# Altium schematic sheet Volatage_regulator.SchDoc
size A4; SheetNumber: 2; SheetTotal: 4
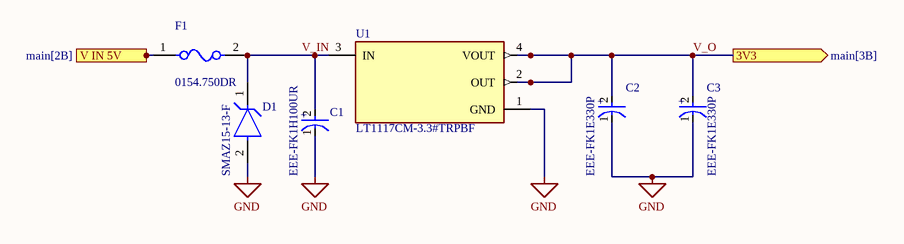
[diagram p0: Volatage_regulator.SchDoc]

## Parts
C1  EEE-FK1H100UR  [FP-FKC-MFG]
C2  EEE-FK1E330P  [FP-FKD-MFG]
C3  EEE-FK1E330P  [FP-FKD-MFG]
D1  SMAZ15-13-F  [FP-SMA-MFG]
F1  0154.750DR  [FP-0154-MFG]
U1  LT1117CM-3.3#TRPBF  [FP-M-3-05-08-1460-MFG]

## Ports
3V3 (out, see main[3B]), V IN 5V (in, see main[2B])

## Nets
GND: C1.1(C) C2.1(C) C3.1(C) D1.2(A) U1.1(GND)
V IN 5V: F1.1 ; port V IN 5V
V_IN: C1.2(A) D1.1(C) F1.2 U1.3(IN)
V_O: C2.2(A) C3.2(A) U1.2(OUT) U1.4(VOUT) ; port 3V3

## Notes on the sheet
- (in symbol CMP-00287-39481004-1) +
- (in symbol CMP-05427-000030-1) +

## Library data of the parts
C1 = CMP-05427-000030-1: CAP ALUM 10UF 20% 50V SMD; Impedance: 1.52R; Ripple Current (AC): 85mA; Life (Hours): 2000Hour; Leakage Current: 3uA; Dielectric Material: Aluminium; Length: 5.8mm; Voltage Rating: 50V; Radiation Hardening: No; Max Operating Temperature: 105°C; REACH SVHC: No SVHC; Tolerance: 20%; RoHS Compliant: Yes; Case/Package: Radial; Height: 5.8mm; Voltage: 50V; Diameter: 5mm; Number of Pins: 2; Ripple Current: 85mA; Series: FK; Lead Free: Lead Free; Width: 6.5mm; ESR (Equivalent Series Resistance): 1.52R; Package Quantity: 1000; Construction: Cylindrical; Voltage Rating (DC): 50V; Packaging: Tape and Reel; Height - Seated (Max): 0.228inch; Contact Plating: Tin; Capacitance: 10uF; Min Operating Temperature: -55°C; Termination: SMD/SMT; Material: Aluminium; Mount: Surface Mount
C2 C3 = CMP-00287-39481004-1: EEE-FK1E330P Aluminum Electrolytic Capacitor, 33 uF, 25 V, ± 20%, 2000 hours @ 105°C, Radial Can - SMD; Voltage: 25V; Polarity: Polar; Ripple Current (AC): 240mA; Impedance: 360mΩ; Leakage Current: 3µA; Capacitance: 33µF; Mount: PCB, Surface Mount; Radiation Hardening: No; Life (Hours): 2000hours; RoHS: Compliant; Packaging: Cut Tape; Case/Package: Radial; Number of Pins: 2; NexarPartId: 39481004; Contact Plating: Tin; Voltage Rating (DC): 25V; Voltage Rating: 25V; Width: 7.8mm; Diameter: 6.3mm; Termination: SMD/SMT; Min Operating Temperature: -55°C; Schedule B: 8532220020; Lifecycle Status: Production; Lead Free: Lead Free; Tolerance: 20%; REACH SVHC: No SVHC; ESR (Equivalent Series Resistance): 360mΩ; Height - Seated (Max): 6.096mm; Height: 5.8mm; Ripple Current: 240mA; Length: 5.8mm; Max Operating Temperature: 105°C
D1 = CMP-12792-000022-1: DIODE ZENER 15V 1W SMA; Manufacturer: Diodes; Forward Current: 200mA; Max Reverse Leakage Current: 1uA; Max Junction Temp: +150°C; Standoff Height: 0.05mm; Reverse Voltage: 11.4V; Zener Impedance: 10Ω; Max Zener Voltage: 15.75V; ComponentLink2URL: https://www.diodes.com/assets/Datasheets/ds18015.pdf; ComponentLink2Description: Datasheet; Nom Zener Voltage: 15V; Category: Diode; Device Class L2: Diodes; Lead Free: Yes; Power Dissipation: 1W; Automotive: No; Octopart: https://octopart.com/smaz15-13-f-diodes+inc.-334038; Temperature Range Low: -65°C; Temperature Range High: +150°C; Package: SMA; Temperature: -65°C to +150°C; Digikey Description: DIODE ZENER 15V 1W SMA; Manufacturer Part Number: SMAZ15-13-F; Mouser Description: Zener Diodes 15V 1W; Footprint Url: https://www.diodes.com/assets/Package-Files/SMA.pdf; Device Class L3: Zener Diodes; RoHS: TRUE; Device Class L1: Discrete Semiconductors; Height: 2.4mm
F1 = CMP-08605-000067-1: FUSE BOARD MNT 750MA 125VAC/VDC; Manufacturer: Littelfuse Inc; Max Fuse Dc Voltage: 125V; Fuse Current: 0.75A; Fuse Blow Speed: Fast; Device Class L3: unset; Automotive: No; ComponentLink2Description: Datasheet; Max Fuse Ac Voltage: 125V; Temperature Range Low: -55°C; Temperature: -55°C to +125°C; Mouser Description: Fuse Chip Very Fast Acting 0.75A SMD Solder Pad 9.73 X 5.03 X 3.81mm T/R CSA/PSE/UL; ComponentLink2URL: https://www.littelfuse.com/~/media/electronics/datasheets/fuses/littelfuse_fuse_154_154t_154l_154tl_datasheet.pdf.pdf; Category: Fuse; Package: 0154; Manufacturer Part Number: 0154.750DR; RoHS: TRUE; Temperature Range High: +125°C; Device Class L1: Circuit Protection; Lead Free: Yes; Device Class L2: Fuses; Octopart: https://octopart.com/0154.750dr-littelfuse-565855; Digikey Description: FUSE BOARD MNT 750MA 125VAC/VDC; Height: 3.81mm
U1 = CMP-0476-00665-2: IC REG LINEAR 3.3V 800MA D2PAK-3; Min Input Voltage: 2.45V; Polarity: Positive; Power Supply Rejection Ratio (PSRR): 75dB; Number of Regulators: 1; Quiescent Current: 10mA; Operating Supply Current: 5mA; Max Input Voltage: 15V; Dropout Voltage: 1.1V; Number of Pins: 3; Min Operating Temperature: 0°C; Packaging: Tape and Reel; Max Operating Temperature: 125°C; Min Current Limit: 800mA; Series: -; Package Quantity: 750; Lead Free: Lead Free; Output Current: 800mA; Number of Outputs: 1; RoHS Compliant: Yes; Case/Package: M; Radiation Hardening: No; Output Voltage: 3.3V